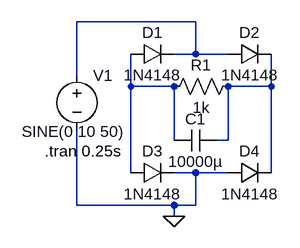
[diagram p0: schematic rectifier_2_2.asc]
rectifier_2_2.asc, the LTspice schematic file:
Version 4
SHEET 1 880 680
WIRE 224 48 48 48
WIRE 224 96 224 48
WIRE 224 96 192 96
WIRE 272 96 224 96
WIRE 48 128 48 48
WIRE 128 144 128 96
WIRE 192 144 128 144
WIRE 336 144 336 96
WIRE 336 144 272 144
WIRE 192 224 192 144
WIRE 272 224 272 144
WIRE 272 224 256 224
WIRE 128 272 128 144
WIRE 224 272 192 272
WIRE 272 272 224 272
WIRE 336 272 336 144
WIRE 48 320 48 208
WIRE 192 320 48 320
WIRE 224 320 224 272
WIRE 224 320 192 320
WIRE 192 336 192 320
FLAG 192 336 0
SYMBOL voltage 48 112 R0
WINDOW 3 -82 99 Left 2
WINDOW 123 0 0 Left 0
WINDOW 39 0 0 Left 0
SYMATTR InstName V1
SYMATTR Value SINE(0 10 50)
SYMBOL diode 128 112 R270
WINDOW 0 32 32 VTop 2
WINDOW 3 0 32 VBottom 2
SYMATTR InstName D1
SYMATTR Value 1N4148
SYMBOL diode 272 112 R270
WINDOW 0 32 32 VTop 2
WINDOW 3 0 32 VBottom 2
SYMATTR InstName D2
SYMATTR Value 1N4148
SYMBOL diode 128 288 R270
WINDOW 0 32 32 VTop 2
WINDOW 3 0 32 VBottom 2
SYMATTR InstName D3
SYMATTR Value 1N4148
SYMBOL diode 272 288 R270
WINDOW 0 32 32 VTop 2
WINDOW 3 0 32 VBottom 2
SYMATTR InstName D4
SYMATTR Value 1N4148
SYMBOL res 288 128 R90
WINDOW 0 0 56 VBottom 2
WINDOW 3 32 56 VTop 2
SYMATTR InstName R1
SYMATTR Value 1k
SYMBOL cap 256 208 R90
WINDOW 0 0 32 VBottom 2
WINDOW 3 32 32 VTop 2
SYMATTR InstName C1
SYMATTR Value 10000µ
TEXT 0 240 Left 2 !.tran 0.25s

The netlist it stands for:
* rectifier_2_2.asc
V1 N001 0 SINE(0 10 50)
D1 N002 N001 1N4148
D2 N001 N003 1N4148
D3 N002 0 1N4148
D4 0 N003 1N4148
R1 N003 N002 1k
C1 N003 N002 10000µ
.model D D
.lib standard.dio
.tran 0.25s
.backanno
.end